# Altium schematic sheet Разъемы.SchDoc
size 420 x 297 mm; Scale: 1:1; DocumentType: Схема электрическая принципиальная; FirstReferrence: АБВГ.123456.001
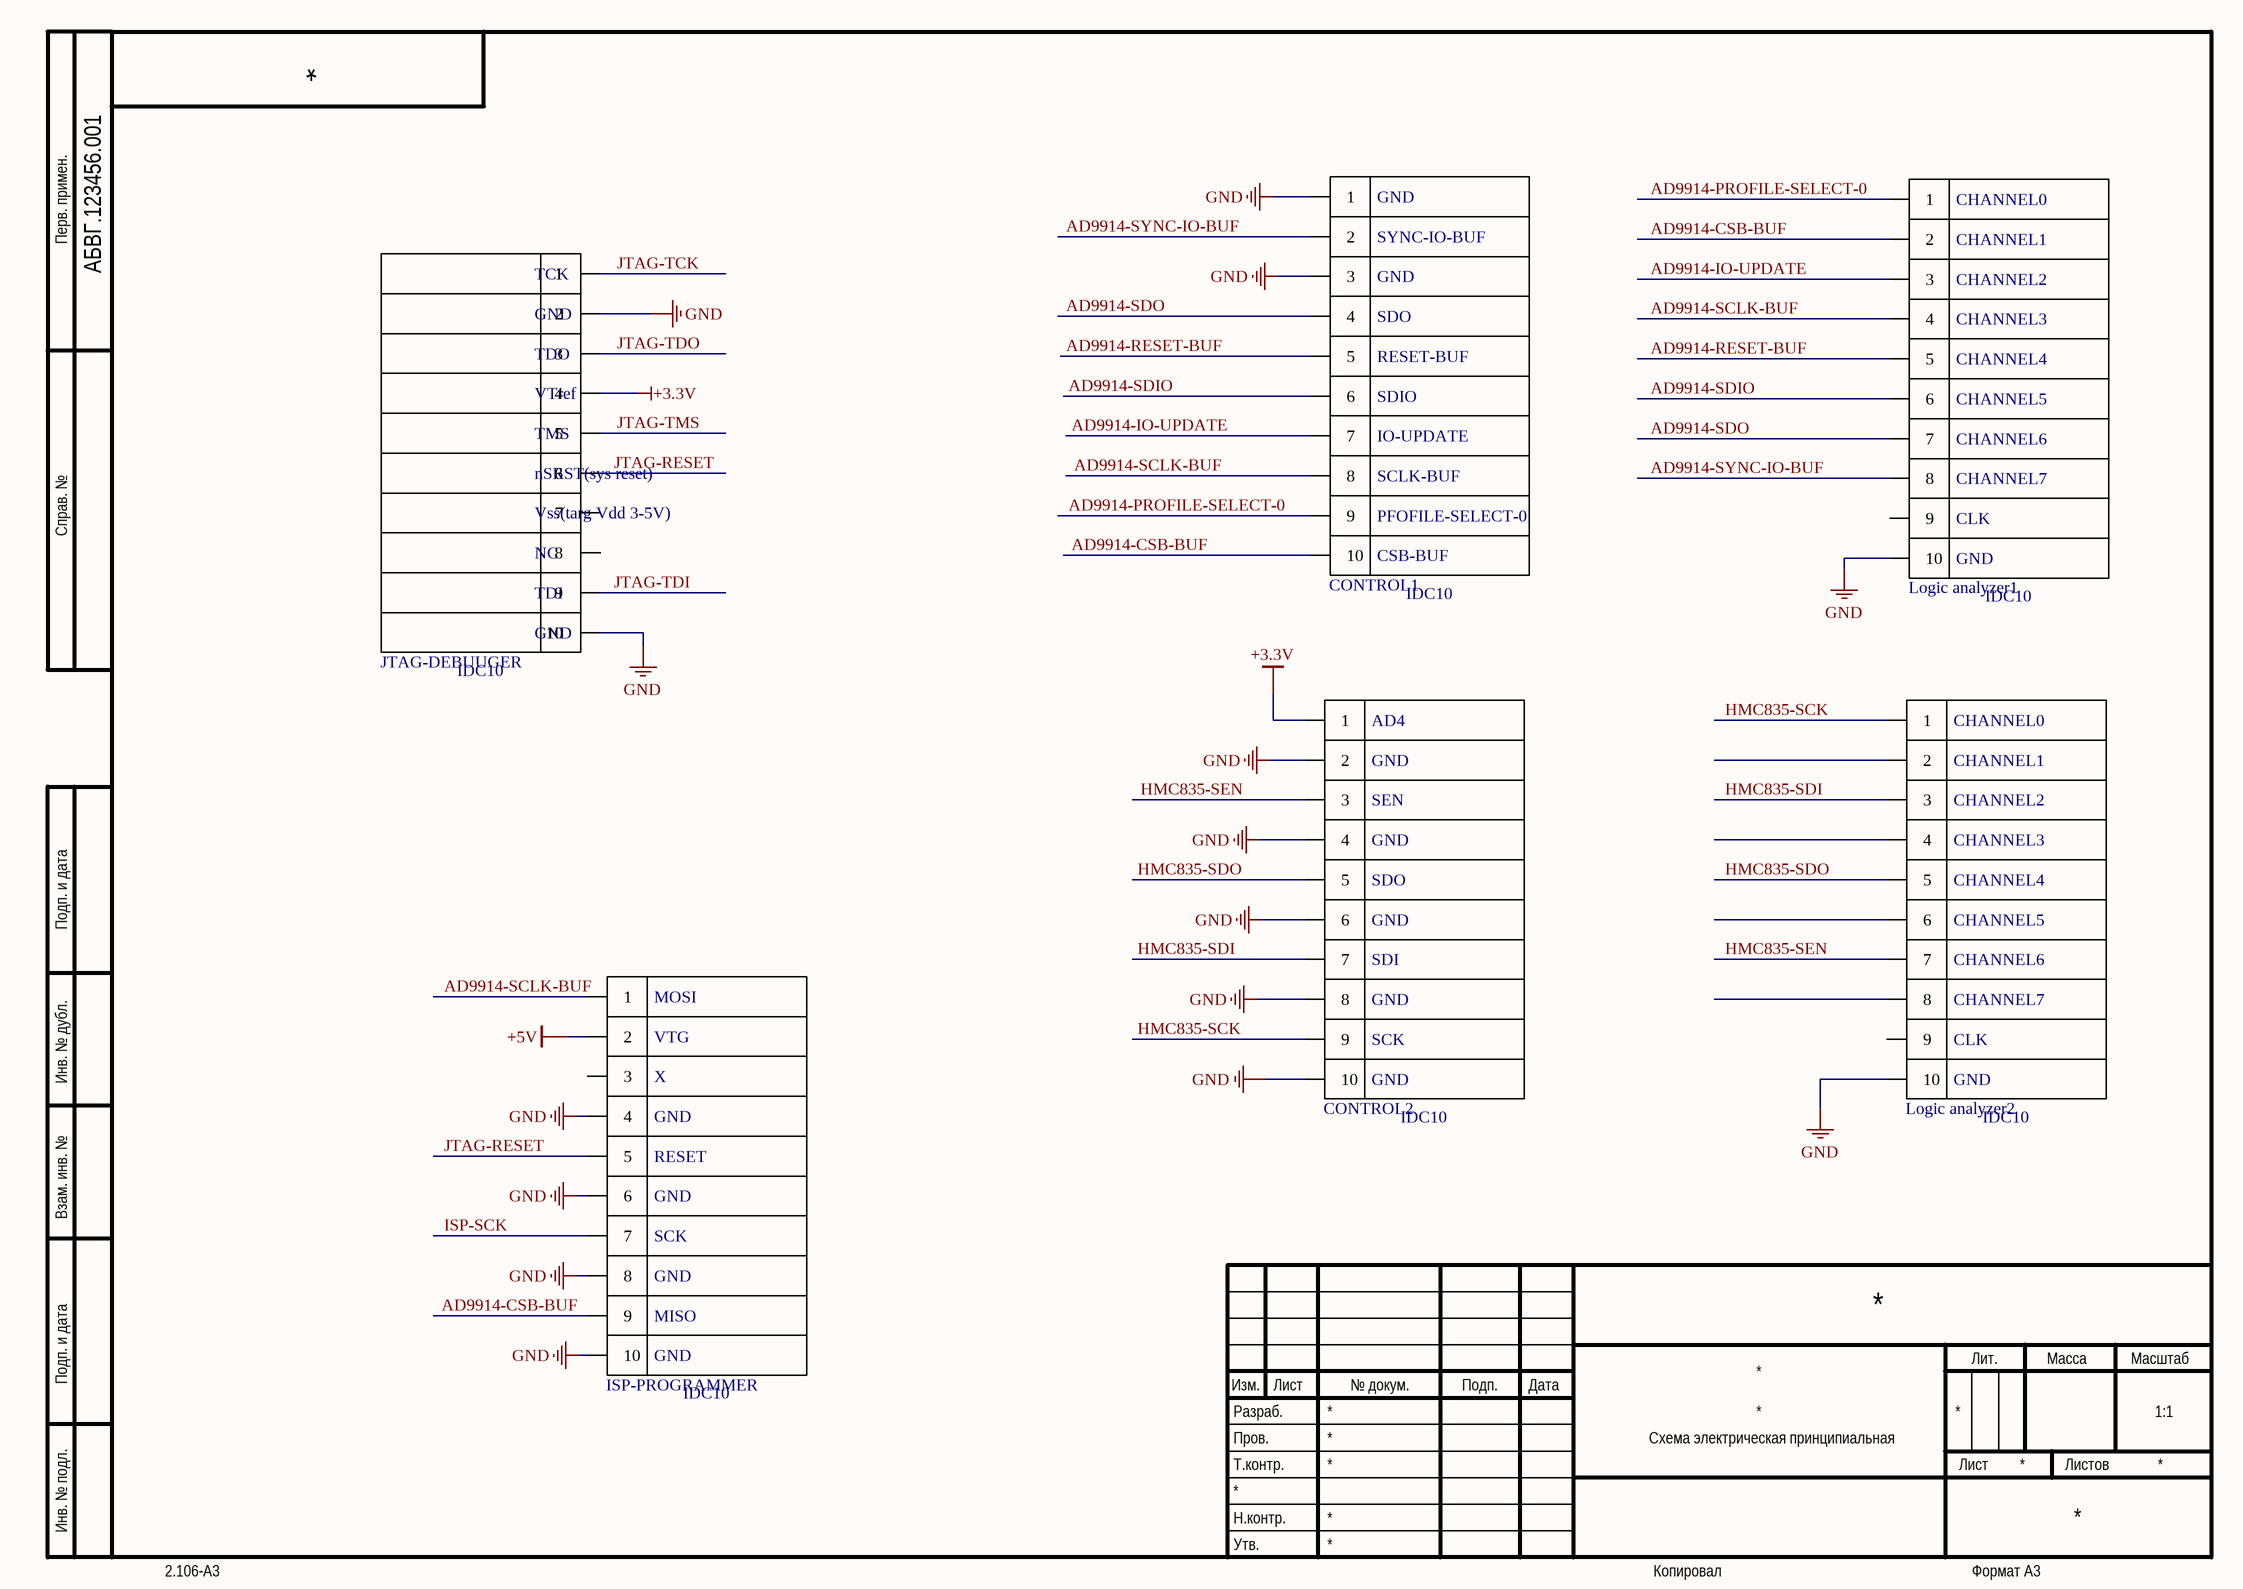
[diagram p0: Разъемы.SchDoc]

## Parts
CONTROL1  IDC10  [IDC10MS]
CONTROL2  IDC10  [IDC10MS]
ISP-PROGRAMMER  IDC10  [IDC10MS]
JTAG-DEBUUGER  IDC10  [IDC10MS]
Logic_analyzer1  IDC10  [IDC10MS]
Logic_analyzer2  IDC10  [IDC10MS]

## Nets
+3.3V: CONTROL2.1 JTAG-DEBUUGER.4
+5V: ISP-PROGRAMMER.2
GND: CONTROL1.1 CONTROL1.3 CONTROL2.2 CONTROL2.4 CONTROL2.6 CONTROL2.8 CONTROL2.10 ISP-PROGRAMMER.4 ISP-PROGRAMMER.6 ISP-PROGRAMMER.8 ISP-PROGRAMMER.10 JTAG-DEBUUGER.2 JTAG-DEBUUGER.10 Logic_analyzer1.10 Logic_analyzer2.10
AD9914-CSB-BUF: CONTROL1.10 ISP-PROGRAMMER.9 Logic_analyzer1.2
AD9914-IO-UPDATE: CONTROL1.7 Logic_analyzer1.3
AD9914-PROFILE-SELECT-0: CONTROL1.9 Logic_analyzer1.1
AD9914-RESET-BUF: CONTROL1.5 Logic_analyzer1.5
AD9914-SCLK-BUF: CONTROL1.8 ISP-PROGRAMMER.1 Logic_analyzer1.4
AD9914-SDIO: CONTROL1.6 Logic_analyzer1.6
AD9914-SDO: CONTROL1.4 Logic_analyzer1.7
AD9914-SYNC-IO-BUF: CONTROL1.2 Logic_analyzer1.8
HMC835-SCK: CONTROL2.9 Logic_analyzer2.1
HMC835-SDI: CONTROL2.7 Logic_analyzer2.3
HMC835-SDO: CONTROL2.5 Logic_analyzer2.5
HMC835-SEN: CONTROL2.3 Logic_analyzer2.7
ISP-SCK: ISP-PROGRAMMER.7
JTAG-RESET: ISP-PROGRAMMER.5 JTAG-DEBUUGER.6
JTAG-TCK: JTAG-DEBUUGER.1
JTAG-TDI: JTAG-DEBUUGER.9
JTAG-TDO: JTAG-DEBUUGER.3
JTAG-TMS: JTAG-DEBUUGER.5

Not connected (* = marked no-connect by the designer): ISP-PROGRAMMER 3; JTAG-DEBUUGER 7 8; Logic_analyzer1 9; Logic_analyzer2 2 4 6 8 9

## Notes on the sheet
- Перв. примен.
- Справ. №
- Подп. и дата
- Инв. № дубл.
- Взам. инв. №
- Разраб.
- Изм.
- Лист
- № докум.
- Подп.
- Дата
- Лит.
- Масса
- Масштаб
- Пров.
- Т.контр.
- Листов
- Инв. № подл.
- Утв.
- Н.контр.
- 2.106-A3
- Копировал
- Формат А3
- (in symbol AD9914_CONTROL) GND; SYNC-IO-BUF; SDO; RESET-BUF; SDIO; IO-UPDATE; SCLK-BUF; PFOFILE-SELECT-0; CSB-BUF
- (in symbol AVR-ISP) MOSI; VTG; X; GND; RESET; SCK; MISO
- (in symbol HMC835_CONTROL) AD4; GND; SEN; SDO; SDI; SCK
- (in symbol JTAG_ICE-10) TCK; GND; TDO; VTref; TMS; nSRST(sys reset); Vss(targ Vdd 3-5V); NC; TDI
- (in symbol Saleae_logic_analyzer) CHANNEL0; CHANNEL1; CHANNEL2; CHANNEL3; CHANNEL4; CHANNEL5; CHANNEL6; CHANNEL7; CLK; GND

## Library data of the parts
CONTROL1 = AD9914_CONTROL: Category: Соединитель; ManufacturerPartNumber: IDC10; PartNumber: IDC10
CONTROL2 = HMC835_CONTROL: Category: Соединитель; ManufacturerPartNumber: IDC10; PartNumber: IDC10
ISP-PROGRAMMER = AVR-ISP: Category: Соединитель; ManufacturerPartNumber: IDC10; PartNumber: IDC10
JTAG-DEBUUGER = JTAG_ICE-10: Category: Соединитель; ManufacturerPartNumber: IDC10; PartNumber: IDC10
Logic_analyzer1 Logic_analyzer2 = Saleae_logic_analyzer: Category: Соединитель; ManufacturerPartNumber: IDC10; PartNumber: IDC10